# Altium schematic sheet TIA.SchDoc
size A4; SheetNumber: 1; SheetTotal: 1; SPICEModelCacheJEDDCWCX: <root> / <DocumentId>JEDDCWCX</DocumentId> / </root>
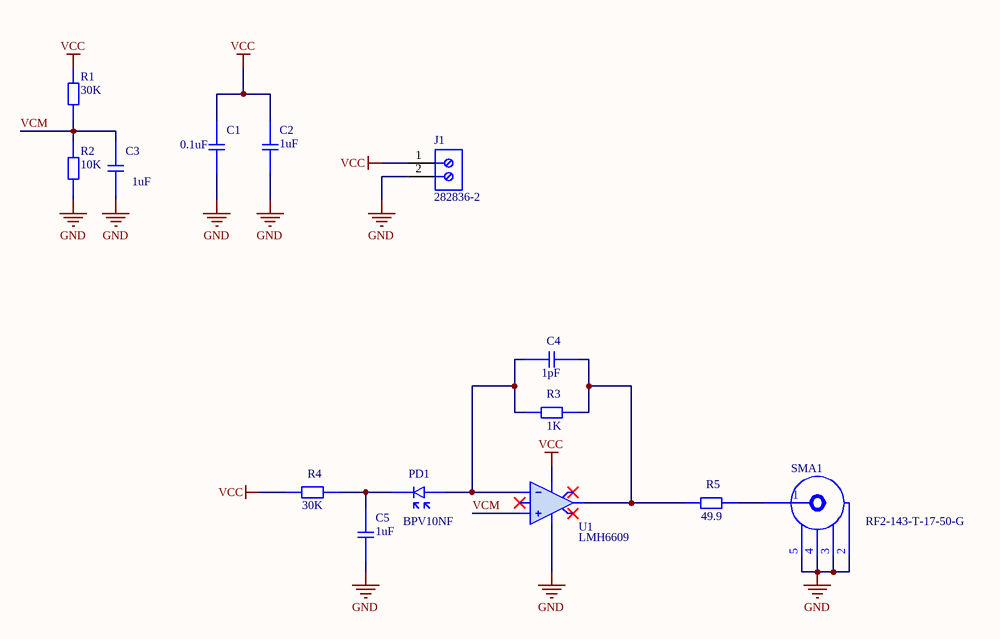
[diagram p0: TIA.SchDoc]

## Parts
C1  0.1uF  [CAPC1608X90X35ML10T15]
C2  1uF  [FP-CC0603-DB-IPC_B]
C3  1uF  [FP-CC0603-DB-IPC_B]
C4  1pF  [FP-C0603C-CF-IPC_B]
C5  1uF  [FP-CC0603-DB-IPC_B]
J1  282836-2  [TECO-282836-2_V]
PD1  BPV10NF  [FP-6_544-5185_02-4-MFG]
R1  30K  [FP-ERA3A-IPC_B]
R2  10K  [FP-AC0603-IPC_B]
R3  1K  [FP-ERA3A-IPC_B]
R4  30K  [FP-ERA3A-IPC_B]
R5  49.9  [RESC1608X55X25ML10T15]
SMA1  RF2-143-T-17-50-G  [SMA_ADAM_TECH]
U1  LMH6609  [D0008A_M]

## Nets
GND: C1.1 C2.1 C3.1 C5.1 J1.2 R2.1 SMA1.2(GND) SMA1.3(GND) SMA1.4(GND) SMA1.5(GND) U1.4(VSN)
VCC: C1.2 C2.2 J1.1 R1.2 R4.1 U1.7(VSP)
VCM: C3.2 R1.1 R2.2 U1.3(INP)
NetC4_1: C4.1 PD1.2(Cathode) R3.1 U1.2(INN)
NetC4_2: C4.2 R3.2 R5.1 U1.6(OUT)
NetC5_2: C5.2 PD1.1(Anode) R4.2
NetR5_2: R5.2 SMA1.1(COAX)

Not connected (* = marked no-connect by the designer): U1 1(N/C)* 5(N/C)* 8(N/C)*

## Library data of the parts
C1-C5 = CAP0603
J1 = CMP-1684-00017-1: Female Header, Pitch 5 mm, 1 x 2 Position, Height 10 mm, Tail Length 3.5 mm, Rohs, Bulk; Manufacturer: TE Connectivity; Wire Gauge: 16-30AWG; Product Training Modules: Wire-to-BoardEurostyleTerminalBlocks; Clamp Material - Plating: Brass-NickelPlated; Voltage: 300V; Mating Orientation: HorizontalwithBoard; Current: 13.5A; Pitch: 0.197"(5.00mm); Screw Thread: M3; 3D Model: 282836-2.pdf; Other Names: 5ULV-02B / A98076; Dynamic Catalog: BuchananSeries; Number of Levels: 1; Torque - Screw: 0.68Nm(6Lb-In); Featured Product: EurostyleTerminalBlockConnectors; Positions Per Level: 2; Wire Termination: Screw-RisingCageClamp; Datasheet URL: http://www.te.com.cn/commerce/DocumentDelivery/DDEController?Action=showdoc&DocId=Catalog+Section%7F1308389_EUROSTYLE_TERMINAL_BLOCKS%7F0607%7Fpdf%7FEnglish%7FENG_CS_1308389_EUROSTYLE_TERMINAL_BLOCKS_0607.pdf%7F282836-2; Color: Green; Family: TerminalBlocks-WiretoBoard; RoHS Information: 282836-2StatementofCompliance; Standard Package: 300; Contact Material - Plating: Brass-TinPlated; Manufacturer URL: http://www.te.com; Housing Material: Polyamide(PA66),Nylon6/6; Features: Interlocking(Side); Package Description: Female Header, Pitch 5 mm, 1 x 2 Position, Height 10 mm, Tail Length 3.5 mm; Mounting Type: ThroughHole; Package Reference: THD; Packaging: Bulk; Series: Buchanan; Category: Connectors,Interconnects; Screw Material - Plating: Brass-NickelPlated
R1-R5 = RES0603
SMA1 = RF2-143-T-17-50-G: Conector:SMA;soclu;mamă;de margine;drept;SMT;pentruPCB;PTFE